# EAGLE schematic Servo (EAGLE 6.0)
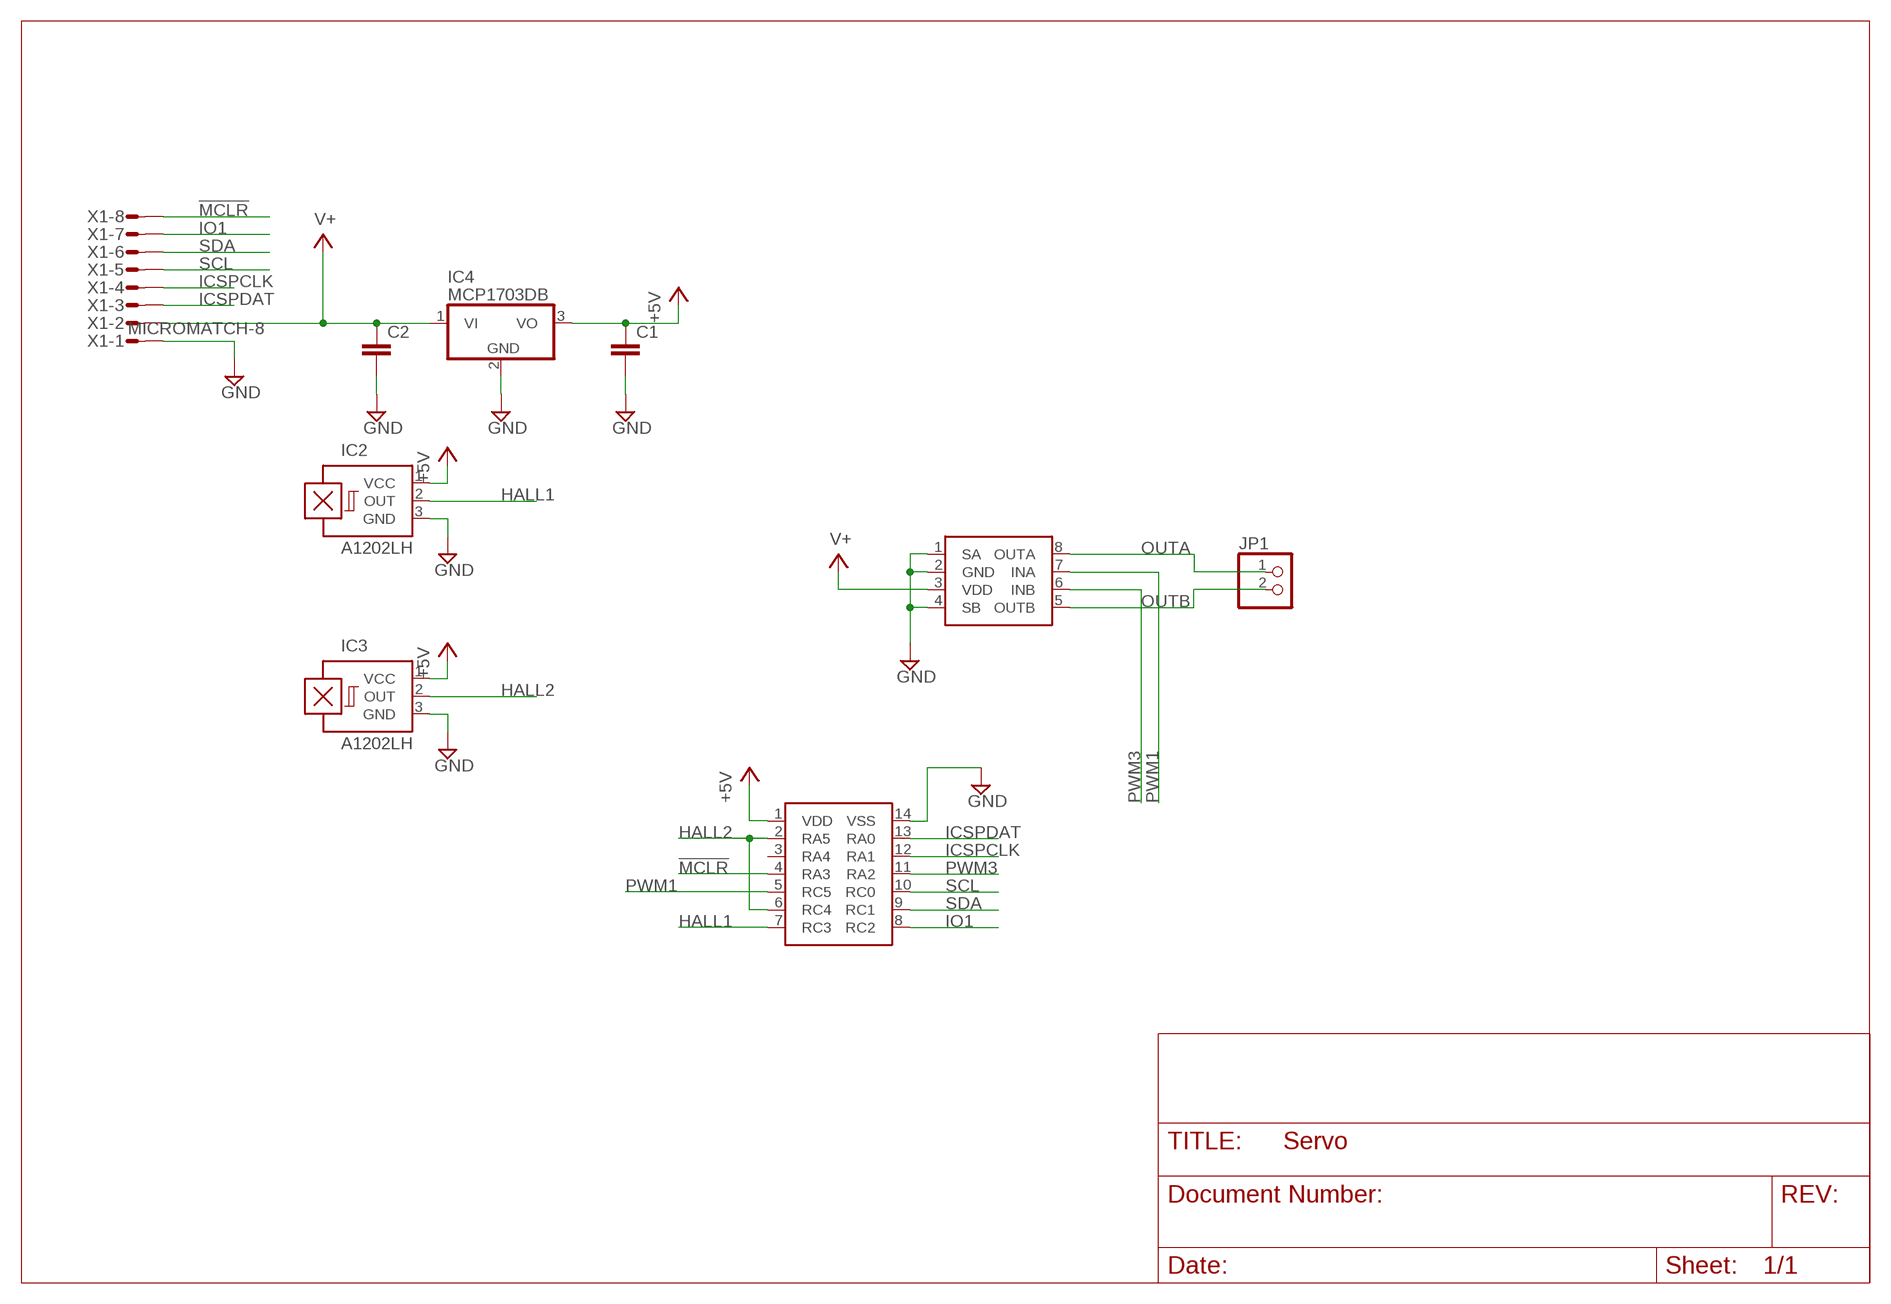
[diagram p0: schematic, sheet 1]

## Parts
C1  C-EUC1206  [C1206]
C2  C-EUC1206  [C1206]
IC2  A1202LH  [SOT23-W]
IC3  A1202LH  [SOT23-W]
IC4  MCP1703DB  [SOT223]
JP1  PINHD-1X2  [1X02]
U$1  PIC16F1503SOIC  [SO-14]
U$2  SI9986SO8  [SO-08]
X1  MICROMATCH-8  [MICROMATCH-8]

## Nets
!MCLR: U$1.4(RA3) X1.8
+5V: C1.1 IC2.1(VCC) IC3.1(VCC) IC4.3(VO) U$1.1(VDD)
GND: C1.2 C2.2 IC2.3(GND) IC3.3(GND) IC4.2(GND) U$1.14(VSS) U$2.1(SA) U$2.2(GND) U$2.4(SB) X1.1
HALL1: IC2.2(OUT) U$1.7(RC3)
HALL2: IC3.2(OUT) U$1.2(RA5) U$1.6(RC4)
ICSPCLK: U$1.12(RA1) X1.4
ICSPDAT: U$1.13(RA0) X1.3
IO1: U$1.8(RC2) X1.7
OUTA: JP1.1 U$2.8(OUTA)
OUTB: JP1.2 U$2.5(OUTB)
PWM1: U$1.5(RC5) U$2.7(INA)
PWM3: U$1.11(RA2) U$2.6(INB)
SCL: U$1.10(RC0) X1.5
SDA: U$1.9(RC1) X1.6
V+: C2.1 IC4.1(VI) U$2.3(VDD) X1.2
Unconnected: U$1.3(RA4)

## Library data of the parts
C1 C2 = rcl:C-EU: CAPACITOR, European symbol
IC2 IC3 = allegro:A12*?: Hall-effect bipolar switch Source: http://www.allegromicro.com/en/Products/Part_Numbers/1202/1202.pdf; OC_FARNELL: unknown; OC_NEWARK: unknown
IC4 = linear:MCP1703: 250 mA, 16V, Low Quiescent Current LDO Regulator Source: http://ww1.microchip.com/downloads/en/DeviceDoc/22049b.pdf
JP1 = pinhead:PINHD-1X2: PIN HEADER
U$1 = PIC16F1503:PIC16F1503
U$2 = si9986:SI9986
X1 = con-amp-micromatch:MICROMATCH-8: MicroMaTch 8 7-215464-8 / 0-215464-8 Drawing Number C-215464 DDEController.pdf; MF: FARNELL; MPN: 7-215464-8; OC_FARNELL: 3784642; OC_NEWARK: 26H0301